# Altium schematic sheet MCU Support.SchDoc
size A4
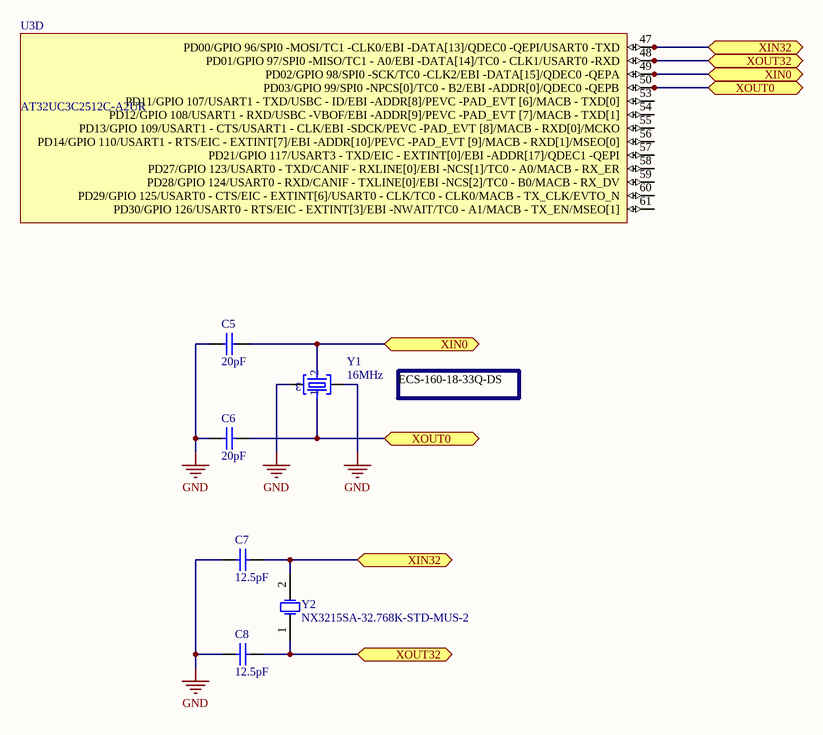
[diagram p0: MCU Support.SchDoc]

## Parts
C5  value 20pF  [0402C-TBD]  (hidden comment: Cap Semi)
C6  value 20pF  [0402C-TBD]  (hidden comment: Cap Semi)
C7  value 12.5pF  [0402C-TBD]  (hidden comment: Cap Semi)
C8  value 12.5pF  [0402C-TBD]  (hidden comment: Cap Semi)
U3  AT32UC3C2512C-A2UR  [TQFP64_N]  (part D of 6)
Y1  16MHz  [CRYSTAL-3.2-2.5]
Y2  NX3215SA-32.768K-STD-MUS-2  [ABRA-ABS07-2_V]

## Ports
XIN0 (bidir), XIN32 (bidir), XOUT0 (bidir), XOUT32 (bidir)

## Nets
GND: C5.2 C6.2 C7.2 C8.2 Y1.2(GND@1) Y1.4(GND@2)
XIN0: C5.1 U3.49(PD02/GPIO_98/SPI0_-SCK/TC0_-CLK2/EBI_-DATA[15]/QDEC0_-QEPA) Y1.3(C2) ; port XIN0
XIN32: C7.1 U3.47(PD00/GPIO_96/SPI0_-MOSI/TC1_-CLK0/EBI_-DATA[13]/QDEC0_-QEPI/USART0_-TXD) Y2.2(X2) ; port XIN32
XOUT0: C6.1 U3.50(PD03/GPIO_99/SPI0_-NPCS[0]/TC0_-_B2/EBI_-ADDR[0]/QDEC0_-QEPB) Y1.1(C1) ; port XOUT0
XOUT32: C8.1 U3.48(PD01/GPIO_97/SPI0_-MISO/TC1_-_A0/EBI_-DATA[14]/TC0_-_CLK1/USART0_-RXD) Y2.1(X1) ; port XOUT32

Not connected (* = marked no-connect by the designer): U3 53(PD11/GPIO_107/USART1_-_TXD/USBC_-_ID/EBI_-ADDR[8]/PEVC_-PAD_EVT_[6]/MACB_-_TXD[0]) 54(PD12/GPIO_108/USART1_-_RXD/USBC_-VBOF/EBI_-ADDR[9]/PEVC_-PAD_EVT_[7]/MACB_-_TXD[1]) 55(PD13/GPIO_109/USART1_-_CTS/USART1_-_CLK/EBI_-SDCK/PEVC_-PAD_EVT_[8]/MACB_-_RXD[0]/MCKO) 56(PD14/GPIO_110/USART1_-_RTS/EIC_-_EXTINT[7]/EBI_-ADDR[10]/PEVC_-PAD_EVT_[9]/MACB_-_RXD[1]/MSEO[0]) 57(PD21/GPIO_117/USART3_-_TXD/EIC_-_EXTINT[0]/EBI_-ADDR[17]/QDEC1_-QEPI) 58(PD27/GPIO_123/USART0_-_TXD/CANIF_-_RXLINE[0]/EBI_-NCS[1]/TC0_-_A0/MACB_-_RX_ER) 59(PD28/GPIO_124/USART0_-_RXD/CANIF_-_TXLINE[0]/EBI_-NCS[2]/TC0_-_B0/MACB_-_RX_DV) 60(PD29/GPIO_125/USART0_-_CTS/EIC_-_EXTINT[6]/USART0_-_CLK/TC0_-_CLK0/MACB_-_TX_CLK/EVTO_N) 61(PD30/GPIO_126/USART0_-_RTS/EIC_-_EXTINT[3]/EBI_-NWAIT/TC0_-_A1/MACB_-_TX_EN/MSEO[1])

## Notes on the sheet
- ECS-160-18-33Q-DS

## Library data of the parts
C5-C8 = Cap Semi: Capacitor (Semiconductor SIM Model); Published: 8-Jun-2000; LatestRevisionDate: 29-May-2009; LatestRevisionNote: IPC-7351 Footprint Added.; PackageReference: C1206; Publisher: Altium Limited; PackageDescription: Chip Capacitor
U3 = CMP-0092-00216-1: 32-bit AVR UC3 C Series Microcontroller, 512KB Flash, 68KB SRAM, 45 GPIO pins, Industrial Grade, 64- Pin TQFP, Reel; ComponentLink3URL: http://www.atmel.com/dyn/resources/prod_documents/32117s.pdf; PackageReference: TQFP64; ComponentLink3Description: AT32UC3C Summary; PackageVersion: 2011; DatasheetVersion: revC, Aug-2011; ComponentLink1Description: Manufacturer URL; ComponentLink2URL: http://www.atmel.com/dyn/resources/prod_documents/doc32117.pdf; ComponentLink2Description: AT32UC3C Datasheet; Code_JEDEC: MS-026; PackageDescription: 64-Pin Thin Quad Flat Pack, 10 x 10 x 1.0 mm Body, 0.5 mm Pitch; ComponentLink1URL: http://www.atmel.com/; PartId: 1
Y1 = CRYSTAL-3.2-2.5: Mouser Part Number: 581-CX3225GB22579PHP
Y2 = CMP-0447-00001-2: Crystal, 32.768 kHz, 12.5 pF, -40 to 85 degC, SMD Low Profile 3.2 x 1.5 x 0.9 mm, Tape and Reel; Manufacturer: Abracon; PartNumber: ABS07-32.768KHz-T; Q Value (Type): 30000; Operation Mode: Flexural Mode (Tuning Fork); Shunt Capacitance (C0): 0.9 to 1.2 pF; Load Capacitance (CL): 12.5 pF; Frequency Tolerance @+25degC: +/- 20 ppm; Drive Level (Type): 0.1 uW; Equivalent Series Resistance (R1): 70 Kohm; Insulation Resistance (Min): 500 Mohm; ComponentLink3URL: http://www.abracon.com/Resonators/ABS07.pdf; PackageDescription: 2-Pin Hand Drawn, Body 3.2x1.5mm, Pitch 2.5mm; Operating Temperature: -40 to 85 degC; ComponentLink2URL: http://www.abracon.com/Resonators/ABS07.pdf; PackageReference: ABS07-2; ComponentLink3Description: Package Specification; ComponentLink1Description: Manufacturer URL; DatasheetVersion: 04.03.13; Mounting Technology: Surface Mount; ComponentLink2Description: Datasheet; ComponentLink1URL: http://www.abracon.com/; Packing: Tape and Reel; Frequency: 32.768 kHz; Digi-Key Part Number: 535-9542-6-ND